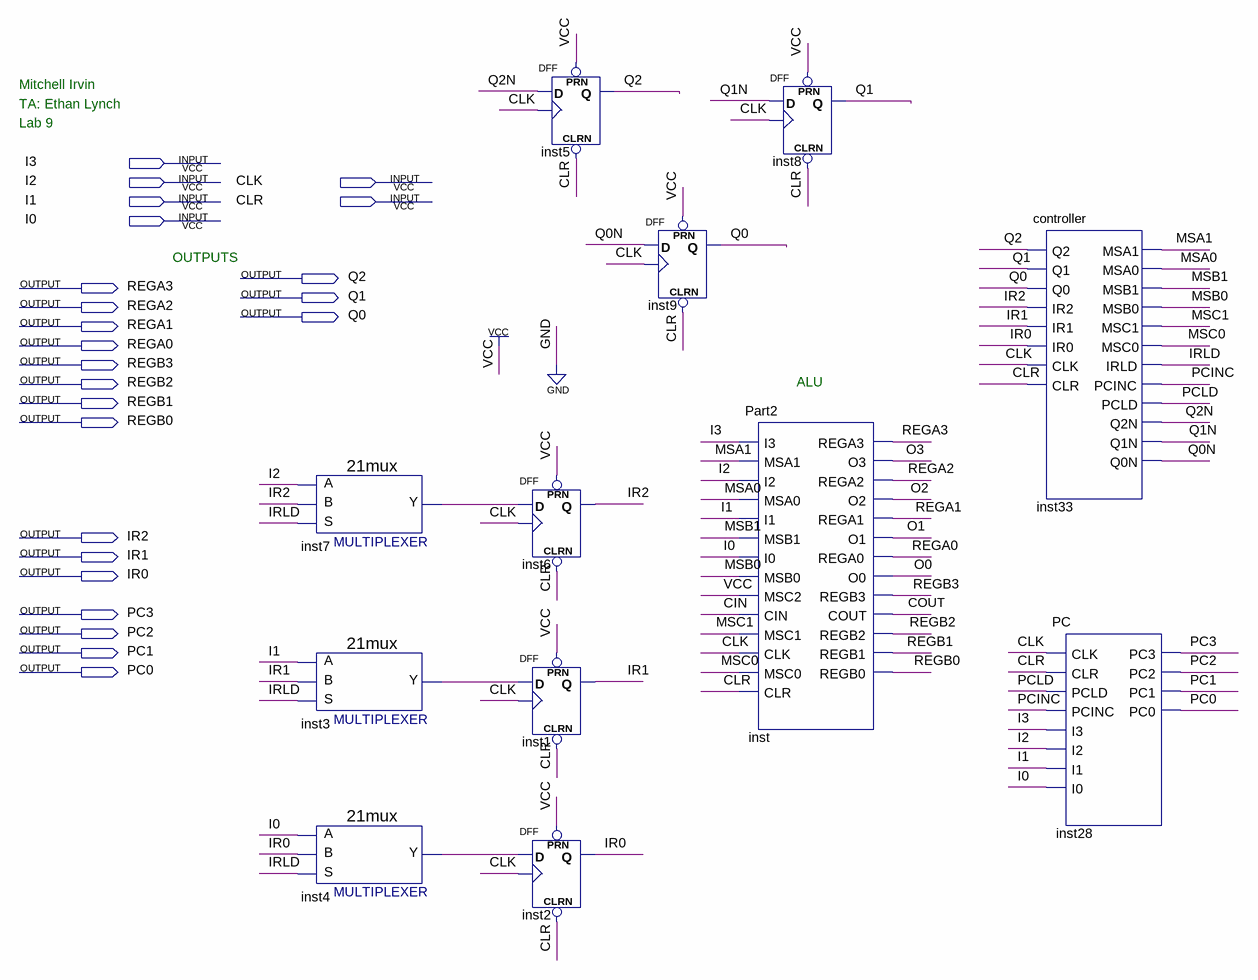
[diagram p0: schematic sheet]
// Quartus schematic Lab9.bdf as structural Verilog: 12 symbols, 24 pins
module Lab9 (
  input  I3,
  input  I2,
  input  CLK,
  input  I1,
  input  CLR,
  input  I0,
  output Q2,
  output REGA3,
  output Q1,
  output REGA2,
  output Q0,
  output REGA1,
  output REGA0,
  output REGB3,
  output REGB2,
  output REGB1,
  output REGB0,
  output IR2,
  output IR1,
  output IR0,
  output PC3,
  output PC2,
  output PC1,
  output PC0
);

  wire CIN, COUT, inst3_y, inst4_y, inst7_y, IRLD, MSA0, MSA1, MSB0, MSB1, MSC0, MSC1, O0, O1, O2, O3, PCINC,
       PCLD, Q0N, Q1N, Q2N;

  \21mux  inst7 (.S(IRLD), .B(IR2), .A(I2), .Y(inst7_y));
  \21mux  inst3 (.S(IRLD), .B(IR1), .A(I1), .Y(inst3_y));
  \21mux  inst4 (.S(IRLD), .B(IR0), .A(I0), .Y(inst4_y));
  DFF inst5 (.CLRN(CLR), .CLK(CLK), .D(Q2N), .PRN(1'b1), .Q(Q2));
  DFF inst6 (.CLRN(CLR), .CLK(CLK), .D(inst7_y), .PRN(1'b1), .Q(IR2));
  DFF inst1 (.CLRN(CLR), .CLK(CLK), .D(inst3_y), .PRN(1'b1), .Q(IR1));
  DFF inst2 (.CLRN(CLR), .CLK(CLK), .D(inst4_y), .PRN(1'b1), .Q(IR0));
  DFF inst9 (.CLRN(CLR), .CLK(CLK), .D(Q0N), .PRN(1'b1), .Q(Q0));
  DFF inst8 (.CLRN(CLR), .CLK(CLK), .D(Q1N), .PRN(1'b1), .Q(Q1));
  Part2 inst (
    .I3(I3), .MSA1(MSA1), .I2(I2), .MSA0(MSA0), .I1(I1), .MSB1(MSB1), .I0(I0), .MSB0(MSB0), .MSC2(1'b1),
    .CIN(CIN), .MSC1(MSC1), .CLK(CLK), .MSC0(MSC0), .CLR(CLR), .REGA3(REGA3), .O3(O3), .REGA2(REGA2),
    .O2(O2), .REGA1(REGA1), .O1(O1), .REGA0(REGA0), .O0(O0), .REGB3(REGB3), .COUT(COUT), .REGB2(REGB2),
    .REGB1(REGB1), .REGB0(REGB0));
  controller inst33 (
    .Q2(Q2), .Q1(Q1), .Q0(Q0), .IR2(IR2), .IR1(IR1), .IR0(IR0), .CLK(CLK), .CLR(CLR), .MSA1(MSA1),
    .MSA0(MSA0), .MSB1(MSB1), .MSB0(MSB0), .MSC1(MSC1), .MSC0(MSC0), .IRLD(IRLD), .PCINC(PCINC), .PCLD(PCLD),
    .Q2N(Q2N), .Q1N(Q1N), .Q0N(Q0N));
  PC inst28 (
    .CLK(CLK), .CLR(CLR), .PCLD(PCLD), .PCINC(PCINC), .I3(I3), .I2(I2), .I1(I1), .I0(I0), .PC3(PC3),
    .PC2(PC2), .PC1(PC1), .PC0(PC0));

  // Notes on the sheet:
  //   Mitchell Irvin
  //   TA: Ethan Lynch
  //   Lab 9
  //   OUTPUTS
  //   ALU
endmodule
